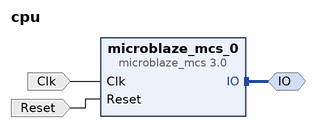
[diagram p0: block diagram of the top level]
# Vivado block design cpu, xc7a100tcsg324-1, Vivado 2018.3
create_bd_design cpu

create_bd_intf_port -mode Master -vlnv xilinx.com:interface:mcsio_bus_rtl:1.0 IO
create_bd_port -dir I -type clk Clk
set_property -dict {CONFIG.ASSOCIATED_RESET Reset} [get_bd_ports Clk]
create_bd_port -dir I -type rst Reset
set_property -dict {CONFIG.POLARITY ACTIVE_LOW} [get_bd_ports Reset]

create_bd_cell -type ip -vlnv xilinx.com:ip:microblaze_mcs:3.0 microblaze_mcs_0
set_property -dict [list \
  CONFIG.DEBUG_ENABLED 2 \
  CONFIG.MEMSIZE 131072 \
  CONFIG.USE_IO_BUS 1 \
  CONFIG.USE_UART_RX 0 \
  CONFIG.USE_UART_TX 0 \
] [get_bd_cells microblaze_mcs_0]

# ---- connections ----

connect_bd_intf_net [get_bd_intf_ports IO] [get_bd_intf_pins microblaze_mcs_0/IO]
connect_bd_net -net Clk_0_1 [get_bd_ports Clk] [get_bd_pins microblaze_mcs_0/Clk]
connect_bd_net -net Reset_0_1 [get_bd_ports Reset] [get_bd_pins microblaze_mcs_0/Reset]

validate_bd_design
save_bd_design
